# Altium schematic sheet 02.BlockDiagram.SchDoc
size A3; SheetNumber: 2; SheetTotal: 4
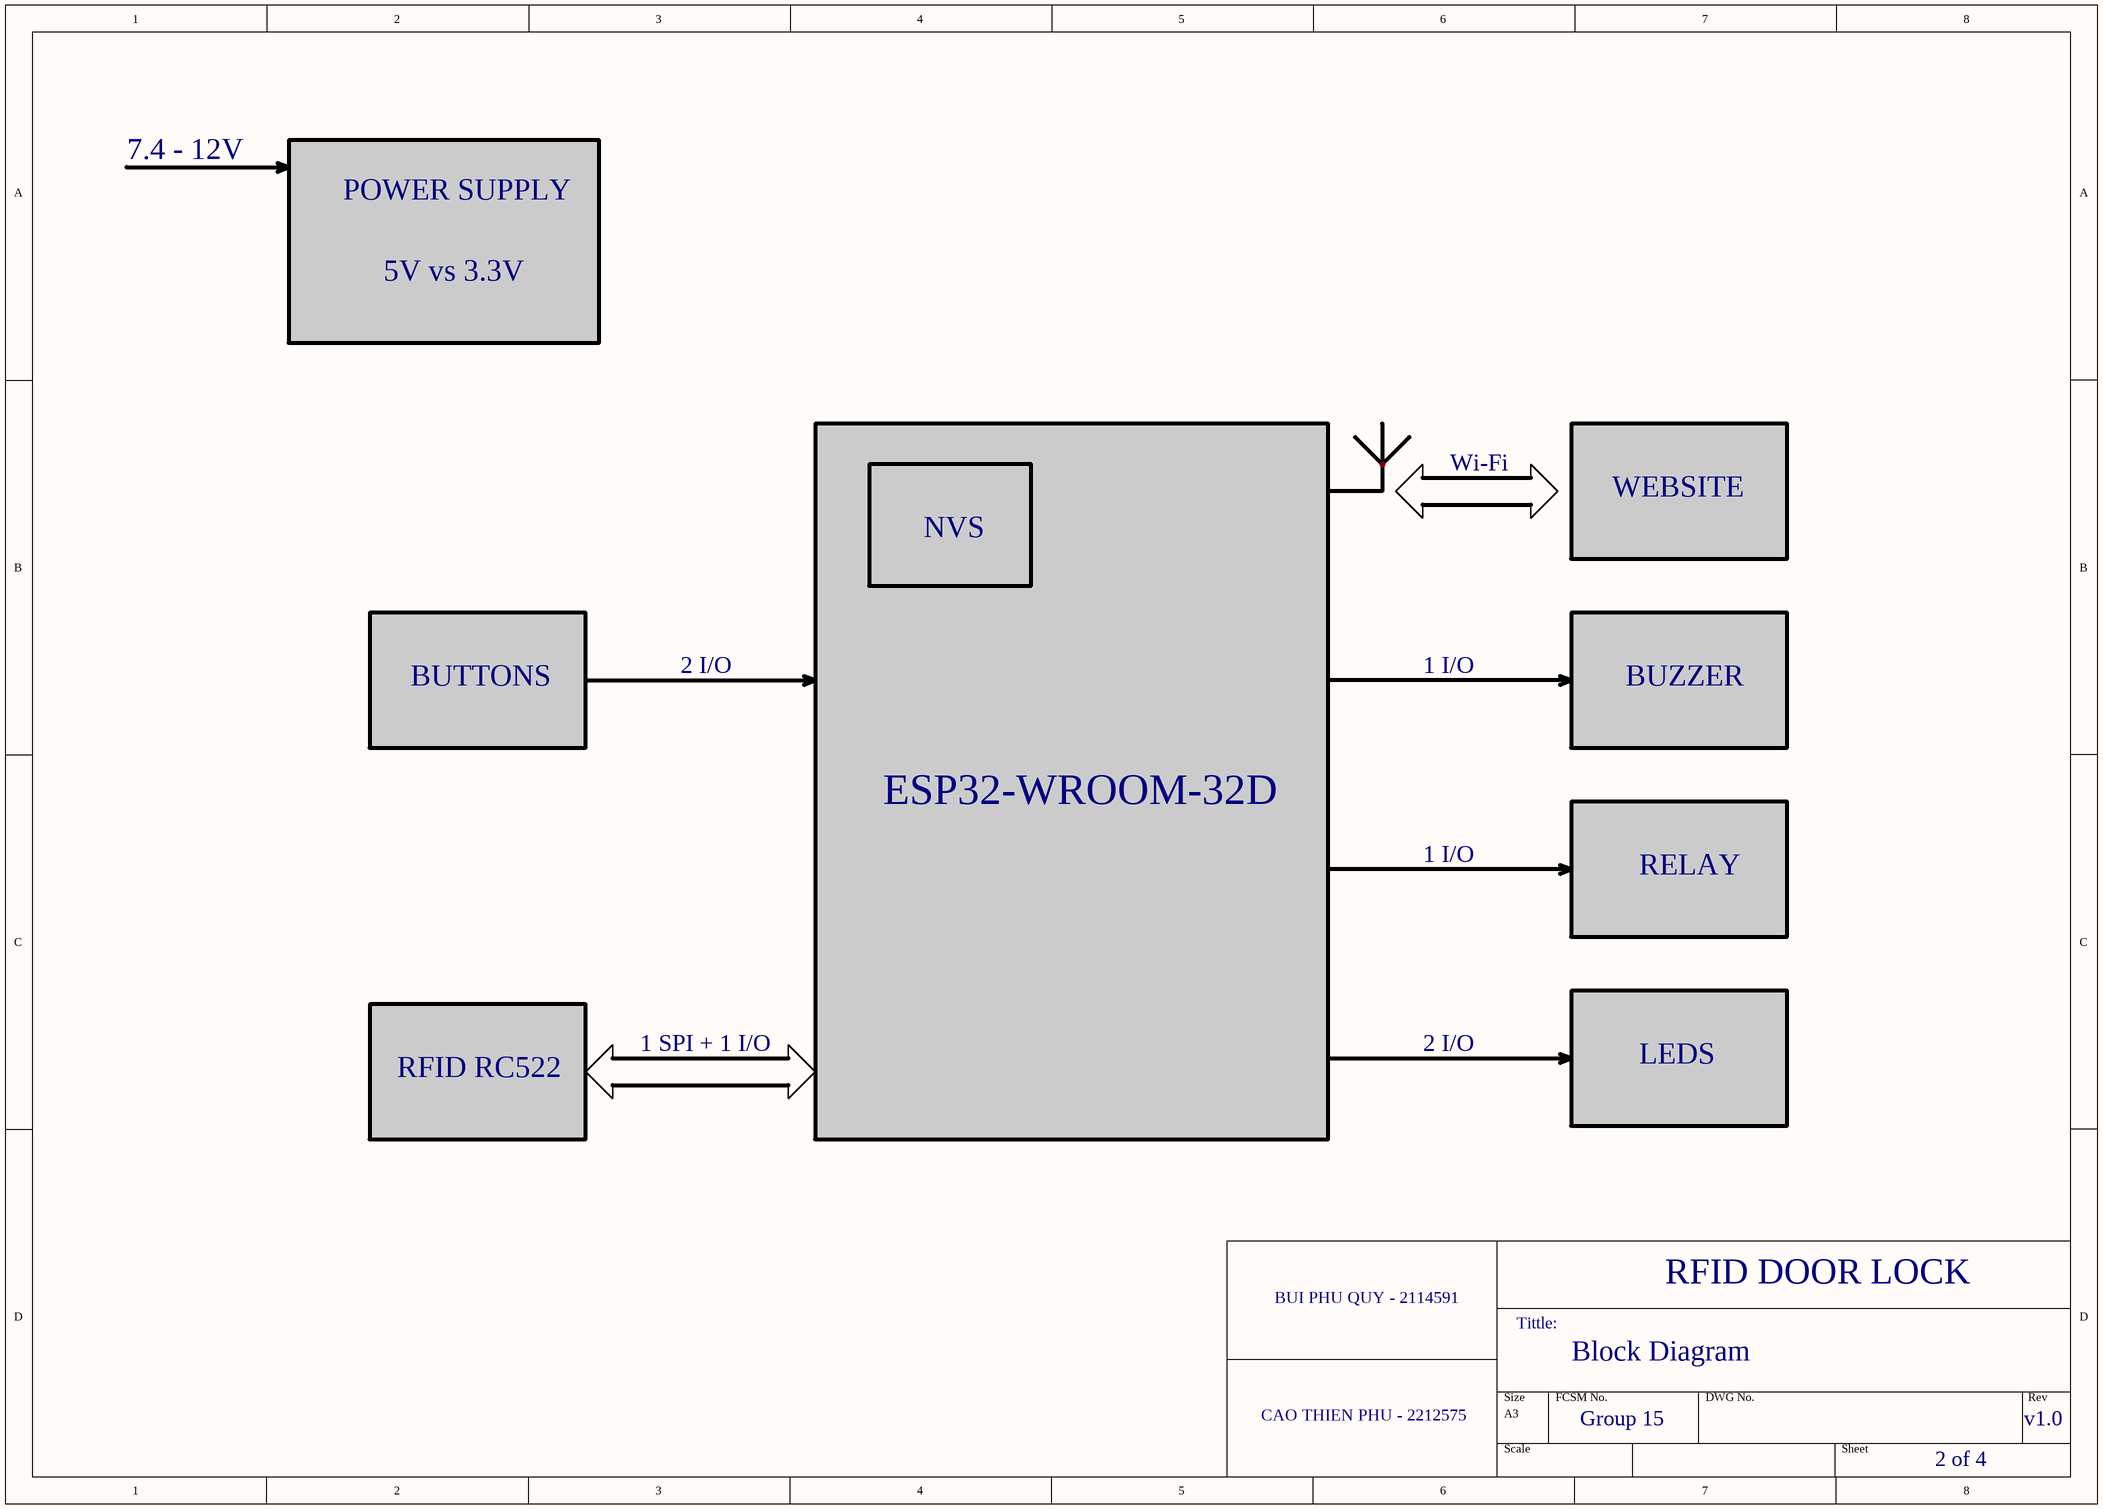
[diagram p0: 02.BlockDiagram.SchDoc]

## Notes on the sheet
- 7.4 - 12V
- POWER SUPPLY
- 5V vs 3.3V
- Wi-Fi
- WEBSITE
- NVS
- BUTTONS
- 2 I/O
- 1 I/O
- BUZZER
- ESP32-WROOM-32D
- RELAY
- 1 SPI + 1 I/O
- RFID RC522
- LEDS
- BUI PHU QUY - 2114591
- Tittle:
- RFID DOOR LOCK
- Block Diagram
- CAO THIEN PHU - 2212575
- Group 15
- v1.0
- 2 of 4